# Altium project KlusterLab r2.0.PrjPcb (part 8 of 10)

## Sheet PSU_VCC2V5_Buck.SchDoc
size A3; SheetNumber: 10; SheetTotal: 32
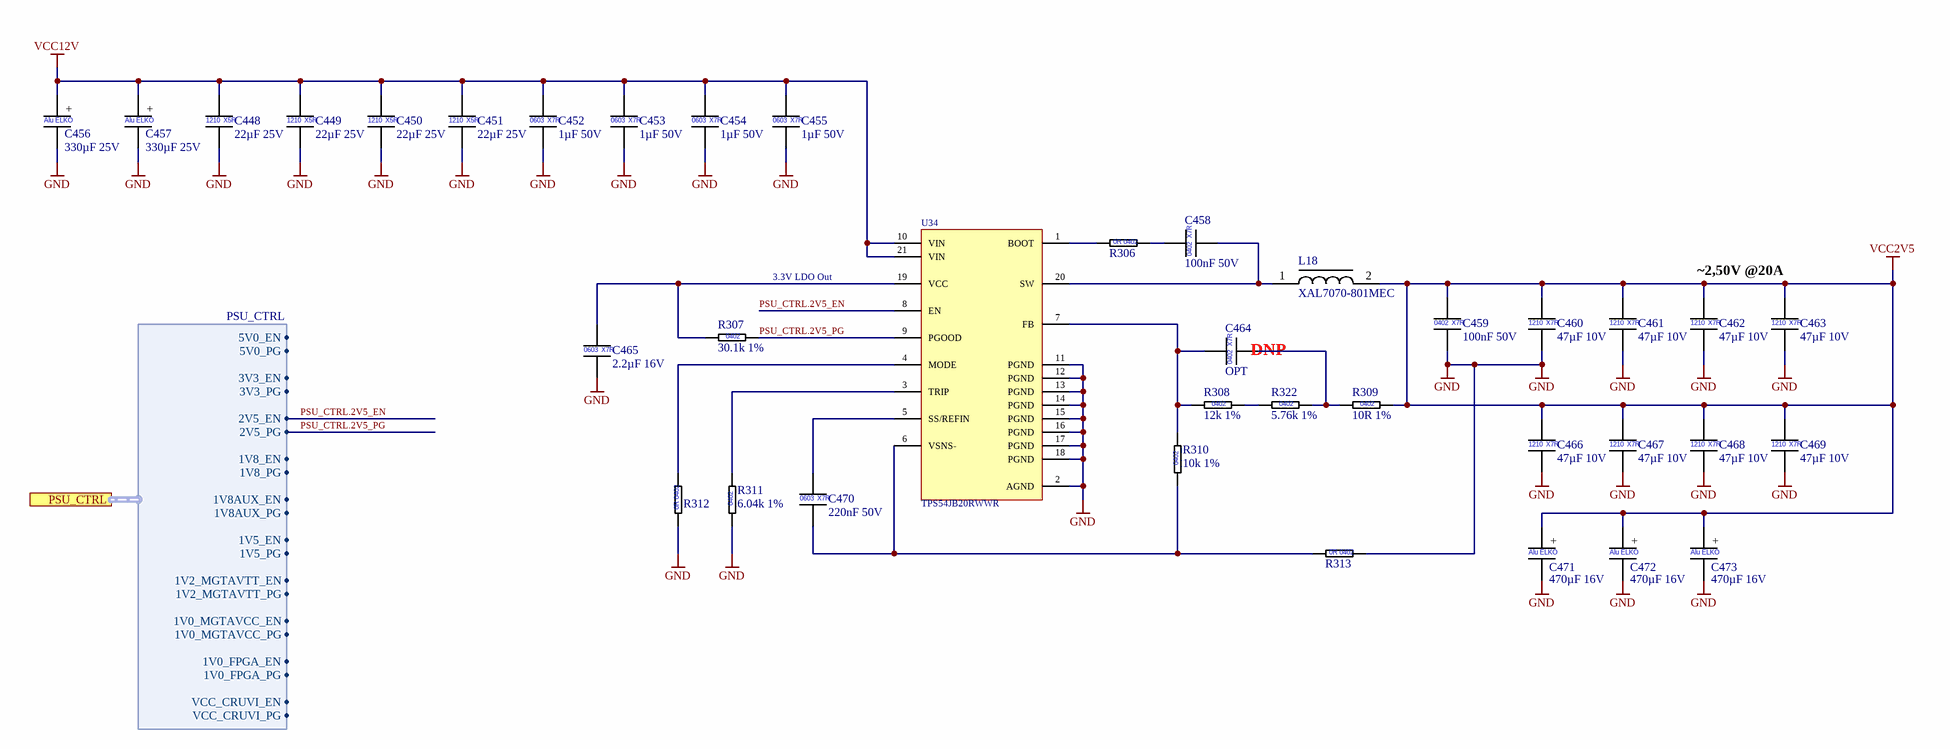
[diagram p24: PSU_VCC2V5_Buck.SchDoc]

### Parts
C448  22µF 25V  [CAP_1210]
C449  22µF 25V  [CAP_1210]
C450  22µF 25V  [CAP_1210]
C451  22µF 25V  [CAP_1210]
C452  1µF 50V  [CAP_0603]
C453  1µF 50V  [CAP_0603]
C454  1µF 50V  [CAP_0603]
C455  1µF 50V  [CAP_0603]
C456  330µF 25V  [WCAP-PTG5_D10H12.5]
C457  330µF 25V  [WCAP-PTG5_D10H12.5]
C458  100nF 50V  [CAP_0402]
C459  100nF 50V  [CAP_0402]
C460  47µF 10V  [CAP_1210]
C461  47µF 10V  [CAP_1210]
C462  47µF 10V  [CAP_1210]
C463  47µF 10V  [CAP_1210]
C464  OPT  [CAP_0402]  (no BOM)
C465  2.2µF 16V  [CAP_0603]
C466  47µF 10V  [CAP_1210]
C467  47µF 10V  [CAP_1210]
C468  47µF 10V  [CAP_1210]
C469  47µF 10V  [CAP_1210]
C470  220nF 50V  [CAP_0603]
C471  470µF 16V  [WCAP-PTG5_D8H13]
C472  470µF 16V  [WCAP-PTG5_D8H13]
C473  470µF 16V  [WCAP-PTG5_D8H13]
L18  XAL7070-801MEC  [COILCRAFT_XAL7070]
R306  0R Jumper  [RES_0402]  (value not drawn)
R307  30.1k 1%  [RES_0402]
R308  12k 1%  [RES_0402]
R309  10R 1%  [RES_0402]
R310  10k 1%  [RES_0402]
R311  6.04k 1%  [RES_0402]
R312  0R Jumper  [RES_0402]  (value not drawn)
R313  0R Jumper  [RES_0402]  (value not drawn)
R322  5.76k 1%  [RES_0402]
U34  TPS54JB20RWWR  [VQFN-HR21_RWW0021A]

### Ports
PSU_CTRL (harness PSU_CTRL, see Power-Tree[2C], PSU_MGTAVCC_Buck[1B], PSU_MGTAVTT_Buck[1B], PSU_VCC1V0_FPGA_Buck[1B], PSU_VCC1V5_Buck[1B], PSU_VCC1V8_Buck[1B], PSU_VCC1V8AUX_Buck[1B], PSU_VCC3V3_Buck[1B], PSU_VCC5V_Buck[1B], PSU_VCC_CRUVI_ADJ_Buck[1B])

### Harnesses
PSU_CTRL: 5V0_EN, 5V0_PG, 3V3_EN, 3V3_PG, 2V5_EN, 2V5_PG, 1V8_EN, 1V8_PG, 1V8AUX_EN, 1V8AUX_PG, 1V5_EN, 1V5_PG, 1V2_MGTAVTT_EN, 1V2_MGTAVTT_PG, 1V0_MGTAVCC_EN, 1V0_MGTAVCC_PG, 1V0_FPGA_EN, 1V0_FPGA_PG, VCC_CRUVI_EN, VCC_CRUVI_PG

### Nets
GND: C448.2 C449.2 C450.2 C451.2 C452.2 C453.2 C454.2 C455.2 C456.2 C457.2 C459.2 C460.2 C461.2 C462.2 C463.2 C465.2 C466.2 C467.2 C468.2 C469.2 C471.2 C472.2 C473.2 R311.1 R312.1 R313.2 U34.2(AGND) U34.11(PGND) U34.12(PGND) U34.13(PGND) U34.14(PGND) U34.15(PGND) U34.16(PGND) U34.17(PGND) U34.18(PGND)
VCC2V5: C459.1 C460.1 C461.1 C462.1 C463.1 C466.1 C467.1 C468.1 C469.1 C471.1 C472.1 C473.1 L18.2 R309.2
VCC12V: C448.1 C449.1 C450.1 C451.1 C452.1 C453.1 C454.1 C455.1 C456.1 C457.1 U34.10(VIN) U34.21(VIN)
PSU_CTRL.2V5_EN: U34.8(EN) ; port PSU_CTRL.2V5_EN
PSU_CTRL.2V5_PG: R307.2 U34.9(PGOOD) ; port PSU_CTRL.2V5_PG
NetC458_1: C458.1 R306.2
NetC458_2: C458.2 L18.1 U34.20(SW)
NetC464_1: C464.1 R308.1 R310.2 U34.7(FB)
NetC464_2: C464.2 R309.1 R322.2
NetC465_1: C465.1 R307.1 U34.19(VCC)
NetC470_1: C470.1 U34.5(SS/REFIN)
NetC470_2: C470.2 R310.1 R313.1 U34.6(VSNS-)
NetR306_1: R306.1 U34.1(BOOT)
NetR308_2: R308.2 R322.1
NetR311_2: R311.2 U34.3(TRIP)
NetR312_2: R312.2 U34.4(MODE)

### Notes on the sheet
- 3.3V LDO Out
- (near C463) ~2,50V @20A
- (near C464) DNP
- Company:
- Contact:
- Customer:
- mail@pcb-arts.com
- PCB Arts GmbH
- Title:
- Project:
- The  information  contained  in  these  documents  is  confidential,  privileged  and  only  for  the information of the intended recipient and may not be used, published or redistributed Without the prior written consent from PCB Arts GmbH.
- Engineer:
- Document Number:
- Revision:
- Variant:
- Date:
- Time:
- Sheet:
- Status:
- /
- (in symbol CAP_0402_100nF_50V) X7R; 0402
- (in symbol CAP_0402_OPT) X7R; 0402
- (in symbol CAP_0603_1µF_50V_X7R_10%) 0603; X7R
- (in symbol CAP_0603_2.2µF_16V_X7R_10%) 0603; X7R
- (in symbol CAP_0603_220nF_50V_X7R_10%) 0603; X7R
- (in symbol CAP_1210_22µF_25V) 1210; X5R
- (in symbol CAP_1210_47µF_10V_X7R_10%) 1210; X7R
- (in symbol CAP_D8L9_470µF_16V) +; Alu ELKO
- (in symbol CAP_D10L12.5_330µF_25V) +; Alu ELKO
- (in symbol RES_0402_0R Jumper) 0R 0402
- (in symbol RES_0402_5.76k_1%) 0402
- (in symbol RES_0402_6.04k_1%) 0402
- (in symbol RES_0402_10k_1%) 0402
- (in symbol RES_0402_10R_1%) 0402
- (in symbol RES_0402_12k_1%) 0402
- (in symbol RES_0402_30.1k_1%) 0402

### Library data of the parts
C448-C451 = CAP_1210_22µF_25V: as C414 on sheet PSU_MGTAVCC_Buck; Manufacturer 2: Taiyo Yuden
C452-C455 = CAP_0603_1µF_50V_X7R_10%: as C425 on sheet PSU_MGTAVCC_Buck; Manufacturer 2: TAIYO YUDEN
C456 C457 = CAP_D10L12.5_330µF_25V: as C281 on sheet Power-Tree
C458 C459 = CAP_0402_100nF_50V: as C250 on sheet Power-Tree; Manufacturer 2: TDK
C460-C463 C466-C469 = CAP_1210_47µF_10V_X7R_10%: as C433 on sheet PSU_MGTAVCC_Buck; Manufacturer 2: KEMET
C464 = CAP_0402_OPT: as C437 on sheet PSU_MGTAVCC_Buck
C465 = CAP_0603_2.2µF_16V_X7R_10%: as C438 on sheet PSU_MGTAVCC_Buck; Manufacturer 2: TAIYO YUDEN
C470 = CAP_0603_220nF_50V_X7R_10%: as C443 on sheet PSU_MGTAVCC_Buck; Manufacturer 2: TDK
C471-C473 = CAP_D8L9_470µF_16V: as C444 on sheet PSU_MGTAVCC_Buck
L18 = XAL7070-801MEC_Power Inductors SMD 800nH Shld 20% 25.8A 2.29mOhms AECQ200: as L17 on sheet PSU_MGTAVCC_Buck; Manufacturer 1 Prt. Nr.: XAL7070-801MEC
R306 R312 R313 = RES_0402_0R Jumper: as R298 on sheet PSU_MGTAVCC_Buck; Manufacturer 2: Yageo
R307 = RES_0402_30.1k_1%: as R299 on sheet PSU_MGTAVCC_Buck; Manufacturer 2: Yageo
R308 = RES_0402_12k_1%: Thick Film Resistors - SMD 12kOhm 1%; Manufacturer 1: Vishay / Dale; Manufacturer 1 Prt. Nr.: CRCW040212K0FKEDC; Manufacturer 2 Prt. Nr.: RC0402FR-7W12KL; Manufacturer 2: Yageo
R309 = RES_0402_10R_1%: as R301 on sheet PSU_MGTAVCC_Buck; Manufacturer 2: Yageo
R310 = RES_0402_10k_1%: as R228 on sheet Power-Tree; Manufacturer 2: Yageo
R311 = RES_0402_6.04k_1%: as R303 on sheet PSU_MGTAVCC_Buck; Manufacturer 2: Yageo
R322 = RES_0402_5.76k_1%: Thick Film Resistors - SMD 5.76kOhm 1%; Manufacturer 1: Vishay / Dale; Manufacturer 1 Prt. Nr.: CRCW04025K76FKED; Manufacturer 2 Prt. Nr.: AC0402FR-075K76L; Manufacturer 2: Yageo
U34 = TPS54JB20RWWR_Switching Voltage Regulators 2.7-V to 16-V input 20-A synchronous Buck: as U33 on sheet PSU_MGTAVCC_Buck; Manufacturer 1 Prt. Nr.: TPS54JB20RWWR

## Sheet PSU_VCC3V3_Buck.SchDoc
size A3; SheetNumber: 11; SheetTotal: 32
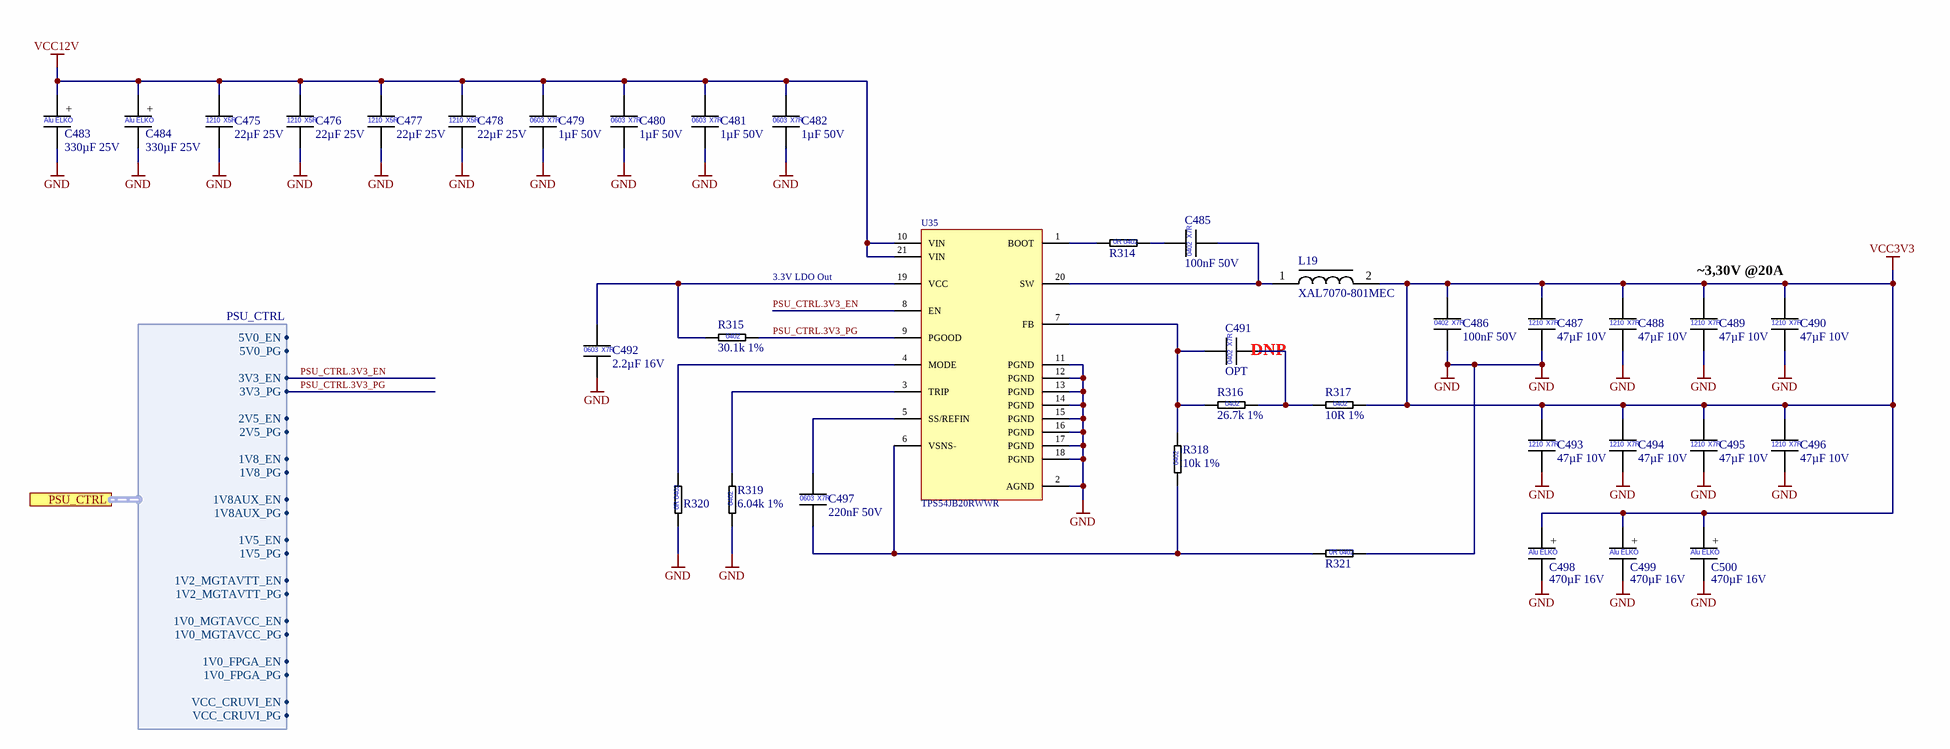
[diagram p25: PSU_VCC3V3_Buck.SchDoc]

### Parts
C475  22µF 25V  [CAP_1210]
C476  22µF 25V  [CAP_1210]
C477  22µF 25V  [CAP_1210]
C478  22µF 25V  [CAP_1210]
C479  1µF 50V  [CAP_0603]
C480  1µF 50V  [CAP_0603]
C481  1µF 50V  [CAP_0603]
C482  1µF 50V  [CAP_0603]
C483  330µF 25V  [WCAP-PTG5_D10H12.5]
C484  330µF 25V  [WCAP-PTG5_D10H12.5]
C485  100nF 50V  [CAP_0402]
C486  100nF 50V  [CAP_0402]
C487  47µF 10V  [CAP_1210]
C488  47µF 10V  [CAP_1210]
C489  47µF 10V  [CAP_1210]
C490  47µF 10V  [CAP_1210]
C491  OPT  [CAP_0402]  (no BOM)
C492  2.2µF 16V  [CAP_0603]
C493  47µF 10V  [CAP_1210]
C494  47µF 10V  [CAP_1210]
C495  47µF 10V  [CAP_1210]
C496  47µF 10V  [CAP_1210]
C497  220nF 50V  [CAP_0603]
C498  470µF 16V  [WCAP-PTG5_D8H13]
C499  470µF 16V  [WCAP-PTG5_D8H13]
C500  470µF 16V  [WCAP-PTG5_D8H13]
L19  XAL7070-801MEC  [COILCRAFT_XAL7070]
R314  0R Jumper  [RES_0402]  (value not drawn)
R315  30.1k 1%  [RES_0402]
R316  26.7k 1%  [RES_0402]
R317  10R 1%  [RES_0402]
R318  10k 1%  [RES_0402]
R319  6.04k 1%  [RES_0402]
R320  0R Jumper  [RES_0402]  (value not drawn)
R321  0R Jumper  [RES_0402]  (value not drawn)
U35  TPS54JB20RWWR  [VQFN-HR21_RWW0021A]

### Ports
PSU_CTRL (harness PSU_CTRL, see Power-Tree[2C], PSU_MGTAVCC_Buck[1B], PSU_MGTAVTT_Buck[1B], PSU_VCC1V0_FPGA_Buck[1B], PSU_VCC1V5_Buck[1B], PSU_VCC1V8_Buck[1B], PSU_VCC1V8AUX_Buck[1B], PSU_VCC2V5_Buck[1B], PSU_VCC5V_Buck[1B], PSU_VCC_CRUVI_ADJ_Buck[1B])

### Harnesses
PSU_CTRL: 5V0_EN, 5V0_PG, 3V3_EN, 3V3_PG, 2V5_EN, 2V5_PG, 1V8_EN, 1V8_PG, 1V8AUX_EN, 1V8AUX_PG, 1V5_EN, 1V5_PG, 1V2_MGTAVTT_EN, 1V2_MGTAVTT_PG, 1V0_MGTAVCC_EN, 1V0_MGTAVCC_PG, 1V0_FPGA_EN, 1V0_FPGA_PG, VCC_CRUVI_EN, VCC_CRUVI_PG

### Nets
GND: C475.2 C476.2 C477.2 C478.2 C479.2 C480.2 C481.2 C482.2 C483.2 C484.2 C486.2 C487.2 C488.2 C489.2 C490.2 C492.2 C493.2 C494.2 C495.2 C496.2 C498.2 C499.2 C500.2 R319.1 R320.1 R321.2 U35.2(AGND) U35.11(PGND) U35.12(PGND) U35.13(PGND) U35.14(PGND) U35.15(PGND) U35.16(PGND) U35.17(PGND) U35.18(PGND)
VCC3V3: C486.1 C487.1 C488.1 C489.1 C490.1 C493.1 C494.1 C495.1 C496.1 C498.1 C499.1 C500.1 L19.2 R317.2
VCC12V: C475.1 C476.1 C477.1 C478.1 C479.1 C480.1 C481.1 C482.1 C483.1 C484.1 U35.10(VIN) U35.21(VIN)
PSU_CTRL.3V3_EN: U35.8(EN) ; port PSU_CTRL.3V3_EN
PSU_CTRL.3V3_PG: R315.2 U35.9(PGOOD) ; port PSU_CTRL.3V3_PG
NetC485_1: C485.1 R314.2
NetC485_2: C485.2 L19.1 U35.20(SW)
NetC491_1: C491.1 R316.1 R318.2 U35.7(FB)
NetC491_2: C491.2 R316.2 R317.1
NetC492_1: C492.1 R315.1 U35.19(VCC)
NetC497_1: C497.1 U35.5(SS/REFIN)
NetC497_2: C497.2 R318.1 R321.1 U35.6(VSNS-)
NetR314_1: R314.1 U35.1(BOOT)
NetR319_2: R319.2 U35.3(TRIP)
NetR320_2: R320.2 U35.4(MODE)

### Notes on the sheet
- 3.3V LDO Out
- (near C490) ~3,30V @20A
- (near C491) DNP
- Company:
- Contact:
- Customer:
- mail@pcb-arts.com
- PCB Arts GmbH
- Title:
- Project:
- The  information  contained  in  these  documents  is  confidential,  privileged  and  only  for  the information of the intended recipient and may not be used, published or redistributed Without the prior written consent from PCB Arts GmbH.
- Engineer:
- Document Number:
- Revision:
- Variant:
- Date:
- Time:
- Sheet:
- Status:
- /
- (in symbol CAP_0402_100nF_50V) X7R; 0402
- (in symbol CAP_0402_OPT) X7R; 0402
- (in symbol CAP_0603_1µF_50V_X7R_10%) 0603; X7R
- (in symbol CAP_0603_2.2µF_16V_X7R_10%) 0603; X7R
- (in symbol CAP_0603_220nF_50V_X7R_10%) 0603; X7R
- (in symbol CAP_1210_22µF_25V) 1210; X5R
- (in symbol CAP_1210_47µF_10V_X7R_10%) 1210; X7R
- (in symbol CAP_D8L9_470µF_16V) +; Alu ELKO
- (in symbol CAP_D10L12.5_330µF_25V) +; Alu ELKO
- (in symbol RES_0402_0R Jumper) 0R 0402
- (in symbol RES_0402_6.04k_1%) 0402
- (in symbol RES_0402_10k_1%) 0402
- (in symbol RES_0402_10R_1%) 0402
- (in symbol RES_0402_26.7k_1%) 0402
- (in symbol RES_0402_30.1k_1%) 0402

### Library data of the parts
C475-C478 = CAP_1210_22µF_25V: as C414 on sheet PSU_MGTAVCC_Buck; Manufacturer 2: Taiyo Yuden
C479-C482 = CAP_0603_1µF_50V_X7R_10%: as C425 on sheet PSU_MGTAVCC_Buck; Manufacturer 2: TAIYO YUDEN
C483 C484 = CAP_D10L12.5_330µF_25V: as C281 on sheet Power-Tree
C485 C486 = CAP_0402_100nF_50V: as C250 on sheet Power-Tree; Manufacturer 2: TDK
C487-C490 C493-C496 = CAP_1210_47µF_10V_X7R_10%: as C433 on sheet PSU_MGTAVCC_Buck; Manufacturer 2: KEMET
C491 = CAP_0402_OPT: as C437 on sheet PSU_MGTAVCC_Buck
C492 = CAP_0603_2.2µF_16V_X7R_10%: as C438 on sheet PSU_MGTAVCC_Buck; Manufacturer 2: TAIYO YUDEN
C497 = CAP_0603_220nF_50V_X7R_10%: as C443 on sheet PSU_MGTAVCC_Buck; Manufacturer 2: TDK
C498-C500 = CAP_D8L9_470µF_16V: as C444 on sheet PSU_MGTAVCC_Buck
L19 = XAL7070-801MEC_Power Inductors SMD 800nH Shld 20% 25.8A 2.29mOhms AECQ200: as L17 on sheet PSU_MGTAVCC_Buck; Manufacturer 1 Prt. Nr.: XAL7070-801MEC
R314 R320 R321 = RES_0402_0R Jumper: as R298 on sheet PSU_MGTAVCC_Buck; Manufacturer 2: Yageo
R315 = RES_0402_30.1k_1%: as R299 on sheet PSU_MGTAVCC_Buck; Manufacturer 2: Yageo
R316 = RES_0402_26.7k_1%: Thick Film Resistors - SMD 26.7kOhm 1%; Manufacturer 1: Vishay / Dale; Manufacturer 1 Prt. Nr.: CRCW040226K7FKEDC; Manufacturer 2 Prt. Nr.: RC0402FR-0726K7L; Manufacturer 2: Yageo
R317 = RES_0402_10R_1%: as R301 on sheet PSU_MGTAVCC_Buck; Manufacturer 2: Yageo
R318 = RES_0402_10k_1%: as R228 on sheet Power-Tree; Manufacturer 2: Yageo
R319 = RES_0402_6.04k_1%: as R303 on sheet PSU_MGTAVCC_Buck; Manufacturer 2: Yageo
U35 = TPS54JB20RWWR_Switching Voltage Regulators 2.7-V to 16-V input 20-A synchronous Buck: as U33 on sheet PSU_MGTAVCC_Buck; Manufacturer 1 Prt. Nr.: TPS54JB20RWWR